# Altium schematic sheet Peripheral.SchDoc
size A4
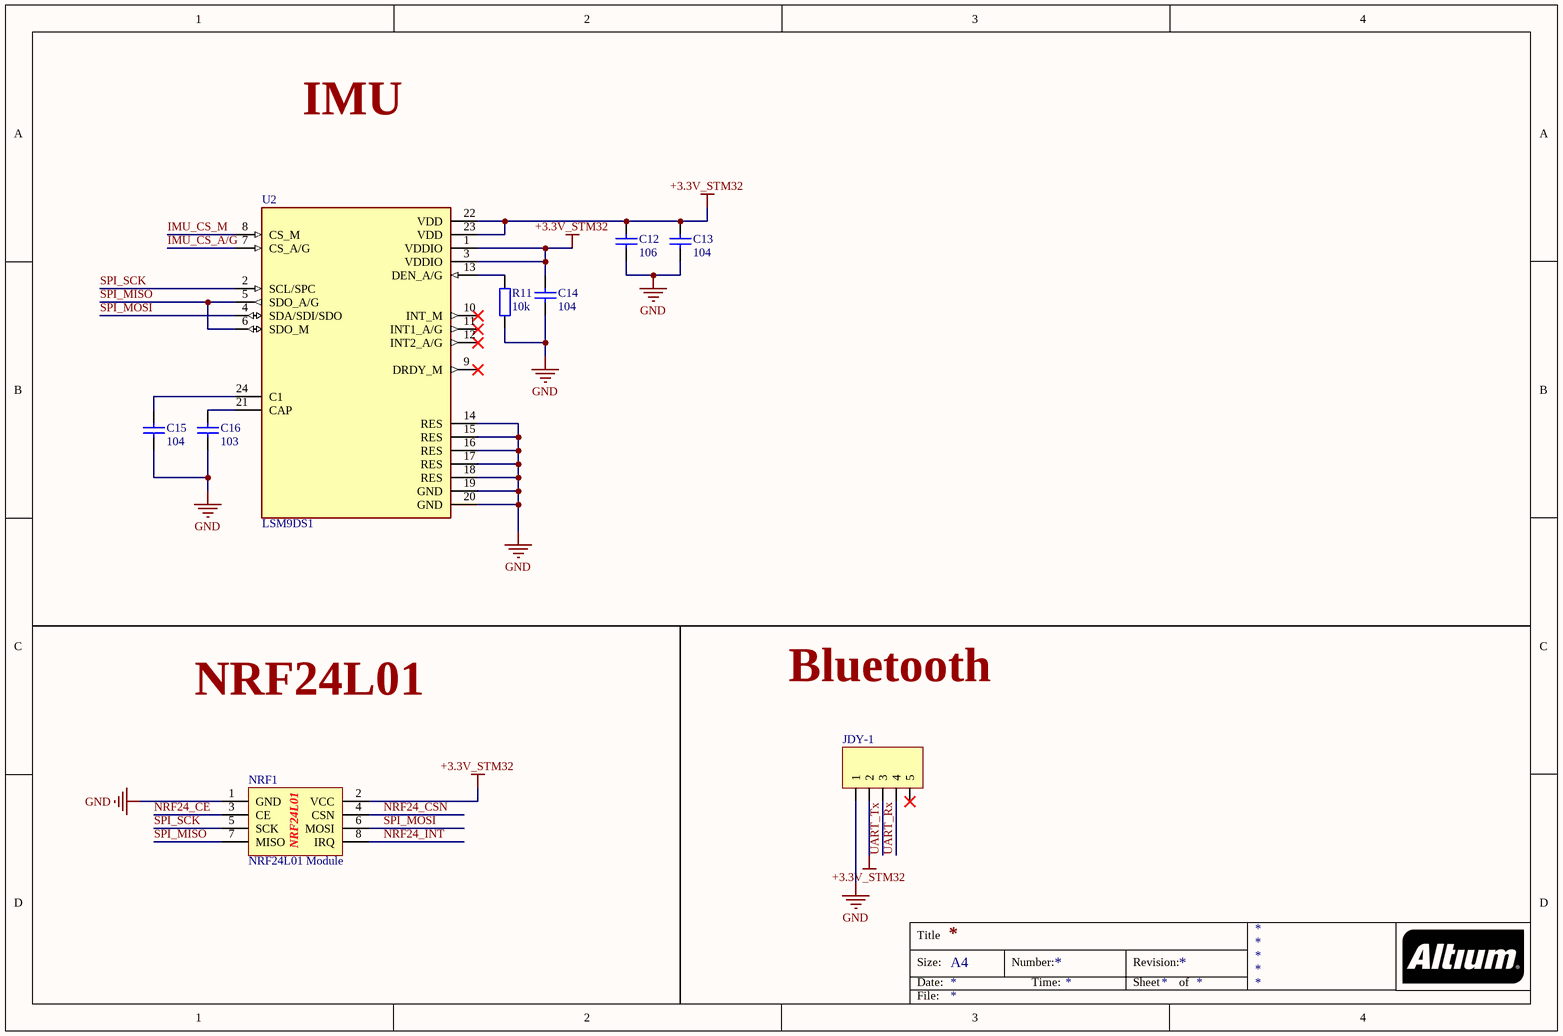
[diagram p0: Peripheral.SchDoc]

## Parts
C12  106  [tu 0603]
C13  104  [tu 0603]
C14  104  [tu 0603]
C15  104  [tu 0603]
C16  103  [tu 0603]
JDY-1  JP 1x5 2.54  [JP 1x5 CC]  (value not drawn)
NRF1  NRF24L01 Module  [NRF24L01]
R11  10k  [tro smd 0603]
U2  LSM9DS1  [PQFN24P43_350X300X102L35X23N]

## Nets
+3.3V_STM32: C12.2 C13.1 C14.1 JDY-1.2 NRF1.2(VCC) U2.1(VDDIO) U2.3(VDDIO) U2.22(VDD) U2.23(VDD)
GND: C12.1 C13.2 C14.2 C15.1 C16.1 JDY-1.1 NRF1.1(GND) R11.1 U2.14(RES) U2.15(RES) U2.16(RES) U2.17(RES) U2.18(RES) U2.19(GND) U2.20(GND)
IMU_CS_A/G: U2.7(CS_A/G)
IMU_CS_M: U2.8(CS_M)
NRF24_CE: NRF1.3(CE)
NRF24_CSN: NRF1.4(CSN)
NRF24_INT: NRF1.8(IRQ)
SPI_MISO: NRF1.7(MISO) U2.5(SDO_A/G) U2.6(SDO_M)
SPI_MOSI: NRF1.6(MOSI) U2.4(SDA/SDI/SDO)
SPI_SCK: NRF1.5(SCK) U2.2(SCL/SPC)
UART_Rx: JDY-1.4
UART_Tx: JDY-1.3
NetC15_2: C15.2 U2.24(C1)
NetC16_2: C16.2 U2.21(CAP)
NetR11_2: R11.2 U2.13(DEN_A/G)

Not connected (* = marked no-connect by the designer): JDY-1 5*; U2 9(DRDY_M)* 10(INT_M)* 11(INT1_A/G)* 12(INT2_A/G)*

## Notes on the sheet
- IMU
- NRF24L01
- Bluetooth
- Title
- Size:
- Date:
- A4
- Number:
- Time:
- Revision:
- Sheet
- of
- File:
- (in symbol NRF24L01 Module) NRF24L01

## Library data of the parts
C12 = Tu 0603 106 16V 20%: Dán; Don_Vi: Con; So_Chan: 2; Ten_Linh_Kien: Tụ 0603-10uF 20% 16V; Ma_Hang: MH004848; Chung_Loai: Dán; Kieu_Chan: *
C13-C15 = Tu 0603 104 50V 10%: Dán; Don_Vi: Con; So_Chan: 2; Ten_Linh_Kien: Tụ 0603 104-100nF 10% 50V; Ma_Hang: MH004568; Chung_Loai: Dán; Kieu_Chan: *
C16 = Tu 0603 103 50V 10%: Dán; Don_Vi: Con; So_Chan: 2; Ten_Linh_Kien: Tụ 0603 103-10nF 10% 50V; Ma_Hang: MH004567; Chung_Loai: Dán; Kieu_Chan: *
JDY-1 = JP 1x5 2.54 Cai Cong: Cắm; Ten_Linh_Kien: Jump Đơn Cái 2.54MM 1x40P Cong; Don_Vi: Con; Ma_Hang: MH001265; Ghi_Chu: *; Kieu_Chan: *; Chung_Loai: Cắm
R11 = Tro 0603 1% 10k: Dán; Don_Vi: Con; So_Chan: 2; Ten_Linh_Kien: Trở 0603 1% 10k; Ma_Hang: MH006333; Chung_Loai: Dán; Kieu_Chan: *
U2 = LSM9DS1: iNEMO inertial module: 3D accelerometer, 3D gyroscope, 3D magnetometer; MF: {'manufacturer': u'STMicroelectronics'}; Package: None; Price: None; Value: *; MP: LSM9DS1; Availability: Unavailable